# EasyEDA Pro project EasyEDAproject_AngstromIO_Mini_Devboard_2026-03-15.epro, board CH32v003 devboard only
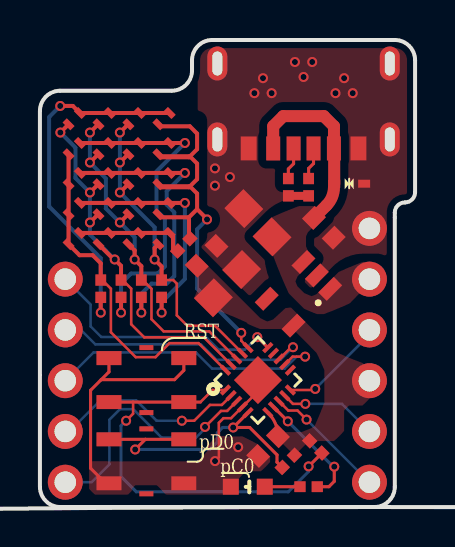
[diagram p5: board, top side]
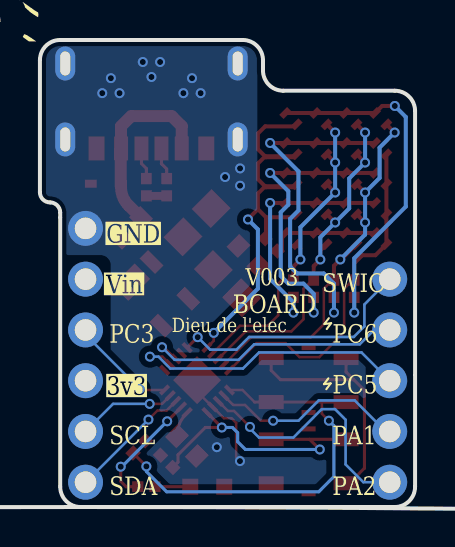
[diagram p6: board, bottom side, seen from below]

Outline 18.8 x 23.37 mm; copper layers: Top Layer, Bottom Layer. Coordinates in mm from the lower left corner of the outline.
Outline path: 14.78,0 1.02,0 arc(0.3,0.3) 0,1.02 0,19.81 arc(0.3,20.53) 1.02,20.83 6.6,20.83 arc(7.32,21.13) 7.62,21.84 7.62,22.35 arc(7.92,23.07) 8.64,23.37 17.78,23.37 arc(18.5,23.07) 18.8,22.35 18.8,15.75 arc(18.65,15.39) 18.29,15.24 arc(17.93,15.09) 17.78,14.73 17.78,1.02 arc(17.48,0.3) 16.76,0 arc(16.76,0) 16.76,0 14.78,0 ; 14.78,0 9.04,0
Stack: Top Layer 0.035mm / Dielectric1 1.51mm FR4 er 4.5 / Bottom Layer 0.035mm

## Design rules (mm)
template: Custom Config
spacing copperThickness1oz (default): track to track 0.102, other pairs 0.152 to 0.3
spacing copperThickness2oz: track to track 0.203, other pairs 0.152 to 0.3
track width copperThickness1oz (default): min 0.127, default 0.254, max 2.54
track width copperThickness2oz: min 0.203, default 0.254, max 2.54
differential pair differentialPair (default): width min 0.127, default 0.254, max 2.54; gap min 0.152, default 0.152
via viaSize (default): diameter min 0.5, default 0.61, max 10; hole min 0.3, default 0.305, max 6.3
net GND uses PGM gnd
pour e1001 uses copperRegion

## Placement (name value [footprint] x y rotation side)
C1  100nF  [0603 CAP clean]  11.43 3.05 225 top
C2  10uF  [C0805]  10.92 14.22 135 top
C3  100nF  [0603 CAP clean]  14.22 13.97 135 top
C4  100nF  [0603 CAP clean]  8.35 12.57 225 top
C5  10uF  [C0805]  9.4 11.18 45 top
D1  LESD5D5.0CT1G  [SOD-523_L1.2-W0.8-LS1.6-BI]  15.49 16.18 180 top
LED1  XL-1608UOC-06  [Dice  0603 LED BLANK]  10.41 1.02 0 top
LED2  XL-1005SURC  [LED0402]  1.72 19.43 45 top
LED3  XL-1005SURC  [LED0402]  3.22 19.43 45 top
LED4  XL-1005SURC  [LED0402]  4.72 19.43 45 top
LED5  XL-1005SURC  [LED0402]  6.22 19.43 45 top
LED6  XL-1005SURC  [LED0402]  1.72 17.93 45 top
LED7  XL-1005SURC  [LED0402]  3.22 17.93 45 top
LED8  XL-1005SURC  [LED0402]  4.72 17.93 45 top
LED9  XL-1005SURC  [LED0402]  6.22 17.93 45 top
LED10  XL-1005SURC  [LED0402]  1.72 16.43 45 top
LED11  XL-1005SURC  [LED0402]  3.22 16.43 45 top
LED12  XL-1005SURC  [LED0402]  4.72 16.43 45 top
LED13  XL-1005SURC  [LED0402]  6.22 16.43 45 top
LED14  XL-1005SURC  [LED0402]  1.72 14.93 45 top
LED15  XL-1005SURC  [LED0402]  3.22 14.93 45 top
LED16  XL-1005SURC  [LED0402]  4.72 14.93 45 top
LED17  XL-1005SURC  [LED0402]  6.22 14.93 45 top
LED18  XL-1005SURC  [LED0402]  1.72 13.43 45 top
LED19  XL-1005SURC  [LED0402]  3.22 13.43 45 top
LED20  XL-1005SURC  [LED0402]  4.72 13.43 45 top
LED21  XL-1005SURC  [LED0402]  6.22 13.43 45 top
NOREF  -  [Pad_e90]  16.51 3.78 0 top
NOREF#2  -  [Pad_e89]  16.51 1.24 0 top
NOREF#3  -  [Pad_e59]  1.27 3.78 0 top
NOREF#4  -  [Pad_e56]  1.27 1.24 0 top
NOREF#5  -  [Pad_e127]  16.51 13.94 0 top
NOREF#6  -  [Pad_e55]  1.27 6.32 0 top
NOREF#7  -  [Pad_e102]  16.51 8.86 0 top
NOREF#8  -  [Pad_e51]  1.27 11.4 0 top
NOREF#9  -  [Pad_e126]  16.51 11.4 0 top
NOREF#10  -  [Pad_e54]  1.27 8.86 0 top
NOREF#11  -  [Pad_e101]  16.51 6.32 0 top
R1  10K  [R0402]  13.82 3.01 135 top
R2  1K  [R0402]  13.46 1.02 0 top
R3  100  [R0402]  3.05 10.92 90 top
R4  100  [R0402]  4.06 10.92 90 top
R5  100  [R0402]  5.08 10.92 90 top
R6  100  [R0402]  6.1 10.92 90 top
R7  100  [R0402]  7.21 13.12 45 top
R8  5.1K  [R0402]  13.46 16 90 top
R9  5.1K  [R0402]  12.45 16 90 top
R10  20K  [R0402]  12.45 2.29 225 top
SW1  TS-1075S-A1B2-D4  [Btn clean]  5.33 6.35 0 top
SW2  TS-1075S-A1B2-D4  [Btn clean]  5.33 2.29 180 top
U1  CH32V003F4U6  [QFN-20_L3.0-W3.0-P0.40-TL-EP1.7]  10.92 6.35 45 top
U2  AP2127K-3.3TRG1  [SOT-23-5_L3.0-W1.7-P0.95-LS2.8-BR]  12.95 10.67 45 top
USB1  TYPE-C 6P(073)  [TYPE-C-SMD_TYPE-C-6P-073]  13.21 20.07 180 top

## Footprints (pads in the part's own frame, mm; a bottom-side part is the same pattern mirrored in y, then rotated)
0603 CAP clean
  rect 0.8x0.9 smd: 1(-0.7,0) 2(0.7,0)
Btn clean
  rect 1.25x0.7 smd: 1(-1.875,1.1) 2(1.875,1.1) 3(-1.875,-1.1) 4(1.875,-1.1)
  rect 0.7x0.25 smd: 5(0,-1.625) 6(0,1.625)
C0805
  rect 1.41x1.35 smd: 1(-1,0) 2(1,0)
Dice  0603 LED BLANK
  rect 0.8x0.8 smd: 1(0.851,0) 2(-0.851,0)
LED0402
  rect 0.3x0.55 smd: 1(-0.4,0) 2(0.4,0)
Pad_e51
  rrect 1.75x1.75 hole 1.08: 1(0,0)
Pad_e54
  rrect 1.75x1.75 hole 1.08: 2(0,0)
Pad_e55
  rrect 1.75x1.75 hole 1.08: 3(0,0)
Pad_e56
  rrect 1.75x1.75 hole 1.08: 4(0,0)
Pad_e59
  rrect 1.75x1.75 hole 1.08: 5(0,0)
Pad_e89
  rrect 1.75x1.75 hole 1.08: 4(0,0)
Pad_e90
  rrect 1.75x1.75 hole 1.08: 5(0,0)
Pad_e101
  rrect 1.75x1.75 hole 1.08: 3(0,0)
Pad_e102
  rrect 1.75x1.75 hole 1.08: 2(0,0)
Pad_e126
  rrect 1.75x1.75 hole 1.08: 2(0,0)
Pad_e127
  rrect 1.75x1.75 hole 1.08: 1(0,0)
QFN-20_L3.0-W3.0-P0.40-TL-EP1.7
  rect 0.6x0.2 smd: 1(-1.5,0.8) 2(-1.5,0.401) 3(-1.5,0) 4(-1.5,-0.4) 5(-1.5,-0.8) 11(1.5,-0.8) 12(1.5,-0.4) 13(1.5,0) 14(1.5,0.401) 15(1.5,0.8)
  rect 0.2x0.6 smd: 6(-0.8,-1.5) 7(-0.4,-1.5) 8(0,-1.5) 9(0.4,-1.5) 10(0.799,-1.5) 16(0.8,1.5) 17(0.4,1.5) 18(0,1.5) 19(-0.4,1.5) 20(-0.8,1.5)
  rect 1.7x1.7 smd: 21(0,0)
R0402
  rect 0.566x0.54 smd: 1(-0.433,0) 2(0.433,0)
SOD-523_L1.2-W0.8-LS1.6-BI
  rect 0.6x0.4 smd: 1(-0.75,0) 2(0.75,0)
SOT-23-5_L3.0-W1.7-P0.95-LS2.8-BR
  rect 1.1x0.6 smd: 1(1.3,-0.95) 2(1.3,0) 3(1.3,0.95) 4(-1.3,0.95) 5(-1.3,-0.95)
TYPE-C-SMD_TYPE-C-6P-073
  oval 1x1.7 hole 0.5x1.2: 7(-4.32,1.675) 7(-4.32,-2.125) 7(4.32,1.675) 7(4.32,-2.125)
  rect 0.7x1.2 smd: A5(-0.5,2.125) A9(1.52,2.125) B5(0.5,2.125) B9(-1.52,2.125)
  rect 0.8x1.2 smd: A12(2.75,2.125) B12(-2.75,2.125)

## Nets
+3.3V: C1.1 C4.2 C5.1 NOREF#11.3 R1.2 R10.1 U1.6 U2.5
GND: C1.2 C2.2 C3.1 C4.1 C5.2 D1.1 LED1.2 NOREF#5.1 R8.1 R9.1 SW1.1 SW1.2 SW2.1 SW2.2 U1.4 U1.21 U2.2 USB1.7 USB1.A12 USB1.B12
VIN: C2.1 C3.2 D1.2 NOREF#9.2 U2.1 U2.3 USB1.A9 USB1.B9
L1: LED6.1 LED10.1 LED14.1 LED18.1 R3.2 U1.20
L2: LED2.1 LED11.1 LED15.1 LED19.1 R4.2 U1.19
L3: LED3.1 LED7.1 LED16.1 LED20.1 R5.2 U1.18
L4: LED4.1 LED8.1 LED12.1 LED21.1 R6.2 U1.17
L5: LED5.1 LED9.1 LED13.1 LED17.1 R7.2 U1.16
PA1: NOREF#3.5 U1.2
PA2: NOREF#4.4 U1.3
PC0: R2.2 U1.7
PC3: NOREF#7.2 U1.10
PC4: U1.11
PC5.FT: NOREF#6.3 U1.12
PC6.FT: NOREF#10.2 U1.13
PC7: U1.14
PD0: R10.2 SW2.3 SW2.4 U1.5
SCL: NOREF.5 U1.9
SDA: NOREF#2.4 U1.8
SWIO: NOREF#8.1 U1.15
$1N428: LED1.1 R2.1
$1N967: R1.1 SW1.3 SW1.4 U1.1
$1N1600: LED2.2 LED3.2 LED4.2 LED5.2 R3.1
$1N2357: LED6.2 LED7.2 LED8.2 LED9.2 R4.1
$1N2614: LED10.2 LED11.2 LED12.2 LED13.2 R5.1
$1N3015: LED14.2 LED15.2 LED16.2 LED17.2 R6.1
$1N3272: LED18.2 LED19.2 LED20.2 LED21.2 R7.1
$1N4160: R9.2 USB1.B5
$1N4165: R8.2 USB1.A5

Pads without a net: SW1 5 6; SW2 5 6; U2 4

## Via types
v1: diameter 0.5, hole 0.305, Top Layer to Bottom Layer, 50 vias

## Routing (per net, layer and track width the routed paths; a pad name or vN(x,y) marks a point on that pad's centre or on a via; arc(x,y) is an arc through that point)
+3.3V: length 1.3
  Top Layer w0.154: U1.6 11.45,4.69 arc(11.8,4.17) C1.1
GND: length 18.3
  Top Layer w0.127: U1.21 10.92,5.79 U1.4 10.14,5.01 9.58,4.45 9.2,4.45 8.96,4.21 8.96,2.49 v1(8.77,2.3)
  Top Layer w0.154: 3.07,6.37 3.46,6.76 SW1.1 ; 3.07,6.37 2.54,5.84 2.54,1.94 3.29,1.19 SW2.2 ; 3.07,6.37 6.74,6.37 7.21,6.84 SW1.2
  Top Layer w0.4: R9.1 R8.1
  vias: v1(8.77,16.94) v1(8.77,16.08) v1(9.52,16.51) v1(9.93,2.99) v1(10.74,20.71) v1(11.18,21.46) v1(11.61,20.71) v1(12.78,22.27) v1(13.21,21.52) v1(13.64,22.27) v1(14.81,20.71) v1(15.24,21.46) v1(15.67,20.71)
VIN: length 9.4
  Top Layer w0.6: USB1.A9 11.69,19.06 12.19,19.56 14.22,19.56 14.73,19.05 14.73,17.95 USB1.B9 arc(14.74,17.92) 14.74,17.9 D1.2 ; C3.2 14.35,15.09 arc(14.63,15.51) 14.73,16
L1: length 17.3
  Top Layer w0.127: R3.2 3.12,11.36 3.56,10.92 3.56,8.74 4.8,7.5 5.79,7.5 6.49,8.2 7.94,8.2 9.3,6.85
  Top Layer w0.2: R3.2 3.05,12.19 2.64,12.6 1.99,12.6 1.44,13.15 1.44,17.65
L2: length 19.9
  Top Layer w0.127: R4.2 4.14,11.36 4.57,10.93 4.57,9.14 5.23,8.49 8.22,8.49 U1.19
  Top Layer w0.2: 2.94,16.15 2.92,16.15 v1(2.5,15.74) ; 2.94,13.15 3.7,12.39 v1(3.75,12.39) 4.06,12.07 R4.2 ; 2.94,14.65 2.92,14.65 v1(2.5,14.24) ; 1.45,19.15 1.44,19.15 v1(1.02,18.74)
  Bottom Layer w0.2: v1(3.75,12.39) 2.5,13.63 v1(2.5,14.24) v1(2.5,15.74) 1.78,16.46 1.78,17.98 v1(1.02,18.74)
L3: length 18.5
  Top Layer w0.127: R5.2 5.15,11.36 5.59,10.92 5.59,9.4 6.2,8.79 8.48,8.79 U1.18
  Top Layer w0.2: 4.44,13.15 4.75,12.84 v1(4.75,12.39) 5.08,12.05 R5.2 ; 2.94,17.65 2.92,17.65 v1(2.5,17.24) ; v1(2.5,18.74) 2.92,19.15 2.94,19.15 ; 4.44,14.65 4.42,14.65 v1(4,14.24)
  Bottom Layer w0.2: v1(2.5,18.74) v1(2.5,17.24) 3.3,16.44 3.3,14.94 v1(4,14.24) 4.75,13.5 v1(4.75,12.39)
L4: length 17.4
  Top Layer w0.127: R6.2 6.68,11.36 6.86,11.18 6.86,9.59 7.38,9.07 8.77,9.07 U1.17
  Top Layer w0.2: R6.2 6.1,12.04 v1(5.75,12.39) 5.75,12.96 5.94,13.15 ; 4.44,17.65 4.42,17.65 v1(4,17.24) ; v1(4,18.74) 4.42,19.15 4.44,19.15 ; v1(4,15.74) 4.42,16.15 4.44,16.15
  Bottom Layer w0.2: v1(5.75,12.39) 5.75,14 v1(4,15.74) v1(4,17.24) v1(4,18.74)
L5: length 24.4
  Top Layer w0.127: U1.16 10.09,8.32 v1(10.09,8.71)
  Top Layer w0.2: 7.52,17.54 7.87,17.9 7.87,18.69 7.51,19.05 6.04,19.05 5.94,19.15 ; 7.52,17.54 7.87,17.19 7.87,16.4 7.52,16.04 ; 7.52,17.54 7.47,17.5 6.09,17.5 6.04,17.55 ; 7.52,17.54 7.51,17.55 6.04,17.55 ; 6.04,16.05 6.09,16 7.47,16 7.52,16.04 ; 6.04,16.05 7.51,16.05 7.52,16.04 ; 6.04,16.05 5.94,16.15 ; 7.52,16.04 7.87,15.69 7.87,14.9 ; 7.47,14.5 6.09,14.5 5.94,14.65 ; 7.47,14.5 7.87,14.9 ; 7.47,14.5 7.47,13.67 7.62,13.53 ; v1(8.37,14.39) 8.37,14.41 7.87,14.9 ; 6.04,17.55 5.94,17.65
  Bottom Layer w0.2: v1(8.37,14.39) 7.87,13.89 7.87,10.93 v1(10.09,8.71)
PA1: length 9.9
  Top Layer w0.127: v1(7.11,4.32) 7.73,4.32 8.52,5.11 9.11,5.11 U1.2
  Bottom Layer w0.127: v1(7.11,4.32) 5.84,4.32 4.83,5.33 3.03,5.33 1.47,3.78 NOREF#3.5
PA2: length 12.8
  Top Layer w0.127: U1.3 9.38,4.81 9.07,4.81 v1(8.27,4.01)
  Bottom Layer w0.127: v1(8.27,4.01) 8.27,3.93 7.82,3.48 6.1,3.48 4.67,4.9 4.01,4.9 3.48,4.37 3.48,2.13 2.59,1.24 NOREF#4.4
PC0: length 6
  Top Layer w0.154: v1(12.42,4.29) 11.7,5.01 ; v1(14.75,2.02) 14.75,1.29 14.48,1.02 R2.2
  Bottom Layer w0.154: v1(14.75,2.02) 14.69,2.02 v1(12.42,4.29)
PC3: length 5.3
  Top Layer w0.127: v1(13.79,5.91) 13.74,5.86 U1.10
  Bottom Layer w0.127: v1(13.79,5.91) 16.51,8.62 NOREF#7.2
PC5.FT: length 14.4
  Top Layer w0.127: 12.27,7.13 12.66,7.52 v1(13.29,7.52)
  Bottom Layer w0.127: v1(13.29,7.52) 12.86,7.52 12.26,6.93 8.62,6.93 7.82,7.73 2.68,7.73 NOREF#6.3
PC6.FT: length 13.2
  Top Layer w0.127: U1.13 12,7.41 12.58,8 v1(12.68,8)
  Bottom Layer w0.127: v1(12.68,8) 12.05,7.37 8.84,7.37 8.06,8.14 2.77,8.14 2.05,8.86 NOREF#10.2
PD0: length 14.7
  Top Layer w0.154: R10.2 11.88,2.24 11.88,2.61 10.51,3.98 v1(9.68,3.98) U1.5 ; SW2.4 5.28,3.39 ; 5.28,3.39 v1(4.77,2.88) ; 5.28,3.39 SW2.3
  Bottom Layer w0.154: v1(4.77,2.88) 8.5,2.88 8.89,3.27 8.89,3.72 9.15,3.98 v1(9.68,3.98)
SCL: length 5
  Top Layer w0.127: U1.9 12.68,5.16 v1(13.3,5.16)
  Bottom Layer w0.127: NOREF.5 15.13,5.16 v1(13.3,5.16)
SDA: length 6.2
  Top Layer w0.127: v1(13.36,4.38) 12.91,4.83 12.45,4.83 U1.8
  Bottom Layer w0.127: NOREF#2.4 16.49,1.24 v1(13.36,4.38)
SWIO: length 12.7
  Top Layer w0.154: U1.15 10.9,8.5 v1(10.89,8.5)
  Bottom Layer w0.127: NOREF#8.1 2.54,10.13 2.54,9.04 3.07,8.51 8.31,8.51 8.95,7.88 10.27,7.88 v1(10.89,8.5)
$1N428: length 1.8
  Top Layer w0.154: LED1.1 R2.1
$1N967: length 21.4
  Top Layer w0.127: 8.04,5.25 8.65,5.86 U1.1 ; v1(4.32,4.32) 4.67,4.67 4.67,5.25
  Top Layer w0.154: v1(13.46,2.03) 14.13,2.7 14.13,2.7 ; SW1.3 SW1.4 8.04,5.25
  Bottom Layer w0.154: v1(4.32,4.32) 4.06,4.06 4.06,1.53 4.83,0.76 12.45,0.76 13.46,1.78 v1(13.46,2.03)
$1N1600: length 18
  Top Layer w0.2: v1(1.02,20.07) 1.65,20.07 2,19.72 6.5,19.72 ; v1(3.05,9.73) R3.1
  Bottom Layer w0.2: v1(3.05,9.73) 3.05,12.45 0.46,15.03 0.46,19.51 v1(1.02,20.07)
$1N2357: length 17
  Top Layer w0.2: 2,18.22 v1(7.26,18.22) ; v1(4.06,9.73) R4.1
  Bottom Layer w0.2: v1(7.26,18.22) 5.84,16.79 5.84,14.84 6.26,14.42 6.26,12.04 5.91,11.69 4.57,11.69 4.06,11.18 v1(4.06,9.73)
$1N2614: length 14.7
  Top Layer w0.2: R5.1 v1(5.08,9.73) ; 2,16.72 v1(7.26,16.72)
  Bottom Layer w0.2: v1(7.26,16.72) 6.35,15.8 6.35,15.13 6.73,14.75 6.73,11.56 6.35,11.18 5.59,11.18 5.08,10.67 v1(5.08,9.73)
$1N3015: length 12
  Top Layer w0.2: R6.1 v1(6.1,9.73) ; v1(7.26,15.22) 2,15.22
  Bottom Layer w0.2: v1(6.1,9.73) 6.1,10.25 7.26,11.41 v1(7.26,15.22)
$1N3272: length 5.7
  Top Layer w0.2: R7.1 6.7,12.81 6.67,12.84 6.67,13.55 6.5,13.72 2,13.72
$1N4160: length 1.6
  Top Layer w0.154: R9.2 12.45,16.92 12.71,17.18 USB1.B5
$1N4165: length 1.6
  Top Layer w0.154: R8.2 13.46,16.94 13.71,17.19 USB1.A5

## Copper pours and planes (outline as drawn; the poured copper is in the pictures)
+3.3V on Top Layer: 7.72,12.26 12.89,12.26 12.89,8.91 7.72,8.91
+3.3V on Top Layer: 11.94,9.29 16.59,9.29 16.59,2.58 11.94,2.58
GND on Top Layer: 2.46,3.56 11.53,3.56 11.53,0.62 2.46,0.62
GND on Top Layer: -0.7,23.53 18.68,23.53 18.68,-0.47 -0.7,-0.47
GND on Bottom Layer: -0.6,23.59 18.97,23.59 18.97,-0.47 -0.6,-0.47
VIN on Top Layer: 11.61,15.06 16.54,15.06 16.54,9.65 11.61,9.65

Small or netless copper shapes (teardrops, artwork), in the pictures only: 1 on Top Layer

## Text on the board
Bottom Solder Mask Layer: CH32 | DEV
Bottom Silkscreen Layer: Dieu de l'elec | V003 | PC6 | PC5 | PA1 | PA2 | SWIO | BOARD | PC3 | SCL | SDA | 3v3 | GND | Vin
Top Silkscreen Layer: RST | pD0 | pC0
